# Altium schematic sheet USB_PHY.SchDoc: RFSoC AMC
size 420 x 297 mm; CmpIndex: 2; CompanyName: WUT; DrawnBy: T. Przywozki; Organization: WUT ISE; Address1: Warsaw University of Technology; Address2: Nowowiejska 15/19 00-665 Warsaw; Address3: Tomasz.Przywozki@pw.edu.pl; DocumentNumber: 37; Revision: 1; SheetNumber: 37; SheetTotal: 45; Project: RFSoC AMC; ModifiedBy: T. Przywozki; CreateDate: -; CheckedDate: -; DivGrp: ISE; Designer: T. Przywozki; ModifiedDate: -; ProjectName: ADC/DAC MEZZANINE
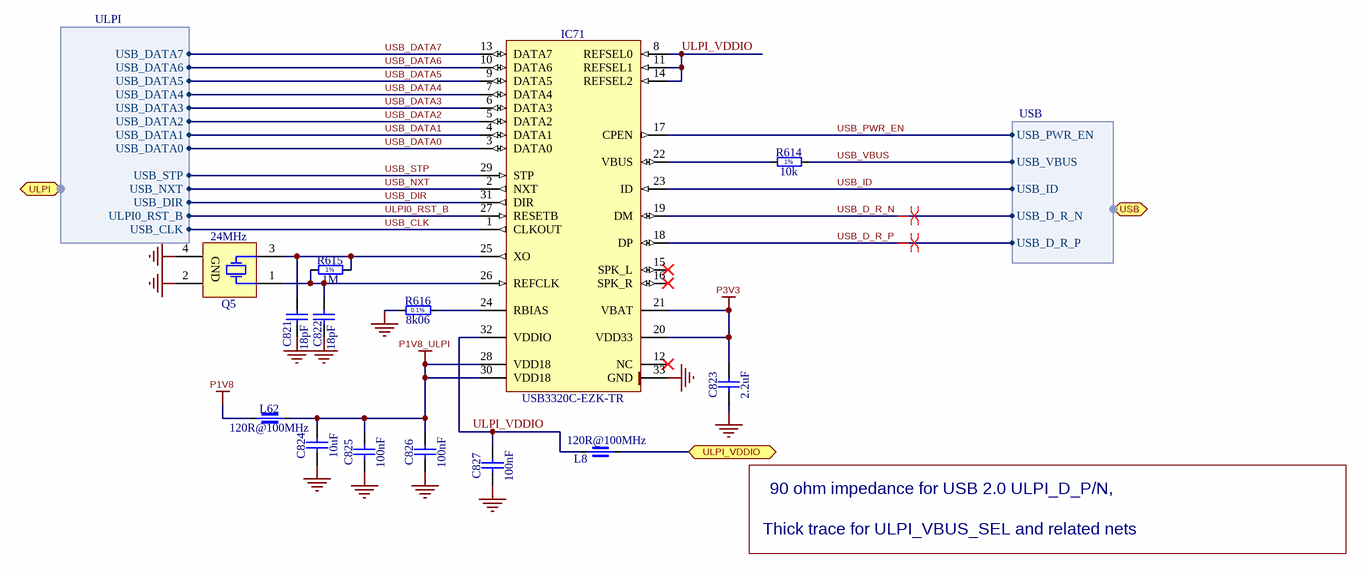
[diagram p0: USB_PHY.SchDoc]

## Parts
C821  18pF  [CAPC1005X55N]
C822  18pF  [CAPC1005X55N]
C823  2.2uF  [CAPC1005X55N]
C824  10uF  [CAPC1608X87N]
C825  100nF  [CAPC0603X33N]
C826  100nF  [CAPC0603X33N]
C827  100nF  [CAPC0603X33N]
IC71  USB3320C-EZK-TR  [QFN50P500X500X100-33N-S340]
L8  120R@100MHz  [INDC1608X95N]
L62  120R@100MHz  [INDC1608X65N]
Q5  24MHz  [XTAL_PERICOM_FL]
R614  10k  [RESC1005X40N]
R615  1M  [RESC1005X40N]
R616  8k06  [RESC1608X55N]

## Ports
ULPI (bidir, harness ULPI), ULPI_VDDIO (bidir), USB (bidir, harness USB)

## Harnesses
USB: USB_D_R_P, USB_PWR_EN, USB_VBUS, USB_D_R_N, USB_ID
ULPI: ULPI0_RST_B, USB_STP, USB_DIR, USB_NXT, USB_CLK, USB_DATA0, USB_DATA1, USB_DATA2, USB_DATA3, USB_DATA4, USB_DATA5, USB_DATA6, USB_DATA7

## Nets
GND: C821.1 C822.1 C823.1 C824.1 C825.2 C826.2 C827.2 IC71.33(GND) Q5.2(GND) Q5.4(GND) R616.1
P1V8: L62.1
P1V8_ULPI: C824.2 C825.1 C826.1 IC71.28(VDD18) IC71.30(VDD18) L62.2
P3V3: C823.2 IC71.20(VDD33) IC71.21(VBAT)
ULPI0_RST_B: IC71.27(RESETB) ; port ULPI.ULPI0_RST_B
ULPI_VDDIO: C827.1 IC71.8(REFSEL0) IC71.11(REFSEL1) IC71.14(REFSEL2) IC71.32(VDDIO) L8.2
ULPI_VDDIO: L8.1 ; port ULPI_VDDIO  [a separate net that carries the same name]
USB_CLK: IC71.1(CLKOUT) ; port ULPI.USB_CLK
USB_D_R_N: IC71.19(DM) ; port USB.USB_D_R_N
USB_D_R_P: IC71.18(DP) ; port USB.USB_D_R_P
USB_DATA0: IC71.3(DATA0) ; port ULPI.USB_DATA0
USB_DATA1: IC71.4(DATA1) ; port ULPI.USB_DATA1
USB_DATA2: IC71.5(DATA2) ; port ULPI.USB_DATA2
USB_DATA3: IC71.6(DATA3) ; port ULPI.USB_DATA3
USB_DATA4: IC71.7(DATA4) ; port ULPI.USB_DATA4
USB_DATA5: IC71.9(DATA5) ; port ULPI.USB_DATA5
USB_DATA6: IC71.10(DATA6) ; port ULPI.USB_DATA6
USB_DATA7: IC71.13(DATA7) ; port ULPI.USB_DATA7
USB_DIR: IC71.31(DIR) ; port ULPI.USB_DIR
USB_ID: IC71.23(ID) ; port USB.USB_ID
USB_NXT: IC71.2(NXT) ; port ULPI.USB_NXT
USB_PWR_EN: IC71.17(CPEN) ; port USB.USB_PWR_EN
USB_STP: IC71.29(STP) ; port ULPI.USB_STP
USB_VBUS: R614.2 ; port USB.USB_VBUS
NetC821_2: C821.2 IC71.25(XO) Q5.3(X) R615.2
NetC822_2: C822.2 IC71.26(REFCLK) Q5.1(X) R615.1
NetIC71_22: IC71.22(VBUS) R614.1
NetIC71_24: IC71.24(RBIAS) R616.2

Not connected (* = marked no-connect by the designer): IC71 12(NC)* 15(SPK_L)* 16(SPK_R)*

## Layout directives
differential pair; differential pair class 100Ohm: USB_D_R_N, USB_D_R_P

## Notes on the sheet
- 90 ohm impedance for USB 2.0 ULPI_D_P/N,
- Thick trace for ULPI_VBUS_SEL and related nets
- Project/Equipment
- Document
- Designer
- Drawn by
- Check.by
- Copyright WUT ISE 2021
  This documentation describes Open Hardware and is licensed under CERN OHL v.1.1. You may redistribute and modify this documentaction under the terms of the CERN OHL v1.1.
  (http://ohwr.org/CERNOHL). This documentation is dristributed WITHOUT ANY EXPRESS OR IMPLIED WARRANTY, INCLUDING OF MERCHANTABLITY, SATISFACTORY QUALITY AND FITNESS FOR A PARTICULAR PURPOSE. Please see the CERN OHL v.1.1 for applicable conditions
- File
- Last Mod.
- Print Date
- Sheet
- Size
- A3
- of
- Rev
- Contact:
- (in symbol R0402_1M_1%_0.0625W_100PPM) 1%
- (in symbol R0402_10K_1%_0.0625W_100PPM) 1%
- (in symbol R0603_8K06_0.1%_0.063W_10PPM) 0.1%

## Library data of the parts
C821 C822 = CC0402_18PF_50V_5%_C0G: Non-polarised capacitor; Manufacturer: GENERIC; Part Description: SMD Multilayer Chip Ceramic Capacitor; Manufacturer1 Part Number: C0402C180J5GACTU; Tolerance: ±5%; Voltage: 50V; TC: C0G/NP0; Manufacturer Part Number: CC0402_18PF_50V_5%_C0G; Part Number: CC0402_18PF_50V_5%_C0G; Value: 18pF; Component Kind: Standard; Component Type: Standard; Pin Count: 2; Status: Preferred; Case: 0402; Mounted: Yes; Socket: No; SMD: Yes; Sense: No; Manufacturer1 Example: KEMET; Manufacturer1 ComponentHeight: 0.55mm; HelpURL: \\cern.ch\dfs\Applications\Altium\Datasheets\CC0805_C0G_KEMET_(Commercial Grade).pdf; Author: CERN DEM JLC; CreateDate: 04.10.2016; LatestRevisionDate: 04.10.2016
C823 = CC0402_2.2UF_6.3V_10%_X5R: Non-polarised capacitor; Manufacturer: GENERIC; Part Description: SMD Multilayer Chip Ceramic Capacitor; Manufacturer1 Part Number: C1005X5R0J225K050BC; Tolerance: ±10%; Voltage: 6.3V; TC: X5R; Manufacturer Part Number: CC0402_2.2UF_6.3V_10%_X5R; Part Number: CC0402_2.2UF_6.3V_10%_X5R; Value: 2.2uF; Component Kind: Standard; Component Type: Standard; Pin Count: 2; Status: Preferred; Case: 0402; Mounted: Yes; Socket: No; SMD: Yes; Sense: No; Manufacturer1 Example: TDK; Manufacturer1 ComponentHeight: 0.55mm; HelpURL: \\cern.ch\dfs\Applications\Altium\Datasheets\CC0402_X5R_TDK_C.pdf; Author: CERN DEM JMW; CreateDate: 22.09.2015; LatestRevisionDate: 22.09.2015
C824 = CC0603_10uF_6.3V_20%_X5R: Non-polarised capacitor; Manufacturer: GENERIC; Part Description: SMD Multilayer Chip Ceramic Capacitor; Manufacturer1 Part Number: C0603C106M9PAC; Tolerance: ±20%; Voltage: 6.3V; TC: X5R; Manufacturer Part Number: CC0603_10uF_6.3V_20%_X5R; Part Number: CC0603_10UF_6.3V_20%_X5R; Value: 10uF; Component Kind: Standard; Component Type: Standard; Pin Count: 2; Status: Preferred; Case: 0603; Mounted: Yes; Socket: No; SMD: Yes; Sense: No; Manufacturer1 Example: KEMET; Manufacturer1 ComponentHeight: 0.95mm; HelpURL: \\cern.ch\dfs\Applications\Altium\Datasheets\CC0603_X5R_KEMET.pdf; Author: CERN DEM JLC; CreateDate: 03.12.2007; LatestRevisionDate: 03.12.2007
C825-C827 = CC0201_100NF_6.3V_10%_X5R: Non-polarised capacitor; Manufacturer: GENERIC; Part Description: SMD Multilayer Chip Ceramic Capacitor; Manufacturer1 Part Number: 02016D104KAT2A; Tolerance: ±10%; Voltage: 6.3V; TC: X5R; Manufacturer Part Number: CC0201_100NF_6.3V_10%_X5R; Part Number: CC0201_100NF_6.3V_10%_X5R; Value: 100nF; Component Kind: Standard; Component Type: Standard; Pin Count: 2; Status: Not Recommended; Case: 0201; Mounted: Yes; Socket: No; SMD: Yes; Sense: No; Manufacturer1 Example: AVX; Manufacturer1 ComponentHeight: 0.33mm; HelpURL: \\cern.ch\dfs\Applications\Altium\Datasheets\CC0201_X5R_AVX.pdf; Author: CERN DEM JLC; CreateDate: 03.12.2007; LatestRevisionDate: 03.12.2007
IC71 = USB3320C-EZK-TR: Highly Integrated, Full Featured Hi-Speed USB 2.0 ULPI Transceiver; Manufacturer: MICROCHIP TECHNOLOGY; PressFit: No; Bonding: No; Manufacturer Part Number: USB3320C-EZK-TR; PackageDescription: QFN, (MO-220-VHHD-2) 0.50mm Pitch,square; 8 pin X 8 pin, 5mm X 5mm X 1.00mm H body (w/thermal tab 3.40 X 3.40mm),  IPC Medium Density; Part Description: Highly Integrated, Full Featured Hi-Speed USB 2.0 ULPI Transceiver; Part Number: USB3320C-EZK-TR; Component Kind: Standard; Component Type: Standard; Device: USB3320C-EZK-TR; Pin Count: 33; Case: QFN32; Mounted: Yes; Socket: No; SMD: Yes; Sense: No; ComponentHeight: 1mm; Author: CERN DEM JLC; HelpURL: \\cern.ch\dfs\Applications\Altium\Datasheets\USB3320C-EZK-TR.pdf; CreateDate: 22.07.2014; LatestRevisionDate: 20.01.2015
L8 = IND0603_MURATA_BLM18PG121SN1D: Manufacturer: MURATA; Part Description: SMD EMIFIL Chip Ferrite Bead; Power: 2A; Resistance: 0.05R; Manufacturer Part Number: BLM18PG121SN1D; Part Number: IND0603_MURATA_BLM18PG121SN1D; Value: 120R@100MHz; Component Kind: Standard; Component Type: Standard; Pin Count: 2; Status: None; Case: 0603; Mounted: Yes; Socket: No; SMD: Yes; Sense: No; ComponentHeight: 0.95mm; HelpURL: \\cern.ch\dfs\Applications\Altium\Datasheets\IND0603_MURATA_BLM18P.pdf; Author: CERN DEM BC; CreateDate: 27/07/2015; LatestRevisionDate: 25/10/2018
L62 = IND0603_MURATA_BLM18SG121TN1D: Manufacturer: MURATA; Part Description: SMD EMIFIL Suppression Chip Ferrite Bead; Tolerance: ±25%; Power: 3A; Resistance: 0.025R; Manufacturer Part Number: BLM18SG121TN1D; Part Number: IND0603_MURATA_BLM18SG121TN1D; Value: 120R@100MHz; Component Kind: Standard; Component Type: Standard; Pin Count: 2; Status: None; Case: 0603; Mounted: Yes; Socket: No; SMD: Yes; Sense: No; ComponentHeight: 0.65mm; HelpURL: \\cern.ch\dfs\Applications\Altium\Datasheets\IND0603_MURATA_BLM18S.pdf; Author: CERN DEM JLC; CreateDate: 23.07.2014; LatestRevisionDate: 25.10.2018
Q5 = XTAL_24MHZ_PERICOM_FL2400041: Crystal 4 pins 1=XTAL Control 2=GND3=XTAL 4=GND; Part Description: Tolerance: ±30ppm, Stability: ±30ppm, -20°C to +70°C, 18pF, SMD Seam Sealing Crystal, FL Series; PressFit: No; Bonding: No; Manufacturer Part Number: FL2400041; Manufacturer: PERICOM; PackageDescription: 4 Pins, 2.5x3.2mm, SMD Sealing Crystal, PERICOM FL Series; Part Number: XTAL_24MHZ_PERICOM_FL2400041; Value: 24MHz; Component Kind: Standard; Component Type: Standard; Pin Count: 2; Mounted: Yes; Socket: No; SMD: Yes; Sense: No; ComponentHeight: 0.75mm; HelpURL: \\cern.ch\dfs\Applications\Altium\Datasheets\XTAL_PERICOM_FL2400041.pdf; Author: CERN DEM JLC; CreateDate: 04.10.2016; LatestRevisionDate: 04.10.2016
R614 = R0402_10K_1%_0.0625W_100PPM: Resistor - 1%; Part Description: General Purpose Thick Film Chip Resistor; Manufacturer: GENERIC; Manufacturer1 Part Number: 232270671003L; TC: ±100ppm/°C; PressFit: No; Part Number: R0402_10K_1%_0.0625W_100PPM; Component Kind: Standard; Component Type: Standard; Pin Count: 2; Value: 10k; Status: Not Recommended; Power: 0.0625W; Tolerance: ±1%; Manufacturer Part Number: R0402_10K_1%_0.0625W_100PPM; Case: 0402; Mounted: Yes; Sense: No; Socket: No; SMD: Yes; Manufacturer1 Example: YAGEO PHYCOMP; Manufacturer1 ComponentHeight: 0.4mm; HelpURL: \\cern.ch\dfs\Applications\Altium\Datasheets\R0402_Phycomp_RC0402.pdf; Author: CERN DEM JLC; CreateDate: 03.12.2007; LatestRevisionDate: 17.10.2012
R615 = R0402_1M_1%_0.0625W_100PPM: Resistor - 1%; Manufacturer: GENERIC; Part Description: General Purpose Thick Film Chip Resistor; Manufacturer1 Part Number: 232270671005L; TC: ±100ppm/°C; PressFit: No; Manufacturer Part Number: R0402_1M_1%_0.0625W_100PPM; Part Number: R0402_1M_1%_0.0625W_100PPM; Tolerance: ±1%; Value: 1M; Component Kind: Standard; Component Type: Standard; Pin Count: 2; Status: Not Recommended; Power: 0.0625W; Case: 0402; Mounted: Yes; Sense: No; Socket: No; SMD: Yes; Manufacturer1 Example: YAGEO PHYCOMP; Manufacturer1 ComponentHeight: 0.4mm; HelpURL: \\cern.ch\dfs\Applications\Altium\Datasheets\R0402_Phycomp_RC0402.pdf; Author: CERN DEM JLC; CreateDate: 03.12.2007; LatestRevisionDate: 17.10.2012
R616 = R0603_8K06_0.1%_0.063W_10PPM: Resistor - 0.1%; Manufacturer: GENERIC; Part Description: Thin Film Chip Resistor; Manufacturer1 Part Number: RN73C1J8K06BTDF; Power: 0.063W; TC: ±10ppm; PressFit: No; Manufacturer Part Number: R0603_8K06_0.1%_0.063W_10PPM; Part Number: R0603_8K06_0.1%_0.063W_10PPM; Tolerance: ±0.1%; Value: 8k06; Component Kind: Standard; Component Type: Standard; Pin Count: 2; Status: Not Recommended; Case: 0603; Mounted: Yes; Sense: No; Socket: No; SMD: Yes; Manufacturer1 Example: TYCO HOLSWORTHY; Manufacturer1 ComponentHeight: 0.5mm; HelpURL: \\cern.ch\dfs\Applications\Altium\Datasheets\R0603_Tyco_RN73.pdf; Author: CERN DEM JLC; CreateDate: 03.12.2007; LatestRevisionDate: 13.03.2008